# Altium schematic sheet Kello_Mechanical.SchDoc
size A4; ApprovedBy: Krzysztof Belewicz; CheckedBy: Krzysztof Belewicz; Author: Krzysztof Belewicz; DrawnBy: Krzysztof Belewicz; Engineer: Krzysztof Belewicz; Revision: 1.0; SheetNumber: 4; SheetTotal: 4
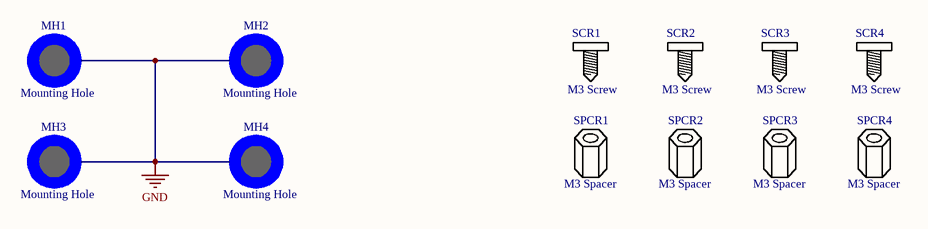
[diagram p0: Kello_Mechanical.SchDoc]

## Parts
MH1  Mounting Hole  [MH-M3_Copper]  (no BOM)
MH2  Mounting Hole  [MH-M3_Copper]  (no BOM)
MH3  Mounting Hole  [MH-M3_Copper]  (no BOM)
MH4  Mounting Hole  [MH-M3_Copper]  (no BOM)
SCR1  M3 Screw  (mechanical)
SCR2  M3 Screw  (mechanical)
SCR3  M3 Screw  (mechanical)
SCR4  M3 Screw  (mechanical)
SPCR1  M3 Spacer  (mechanical)
SPCR2  M3 Spacer  (mechanical)
SPCR3  M3 Spacer  (mechanical)
SPCR4  M3 Spacer  (mechanical)

## Nets
GND: MH1.MH MH2.MH MH3.MH MH4.MH

## Notes on the sheet
- Project:
- Variant:
- File:
- Sheet:
- Revision:
- Total Sheet:
- Author:
- Modified:

## Library data of the parts
MH1-MH4 = MH: M3 mounting hole
SCR1-SCR4 = SCREW: Supplier 1: *; Manufacturer 1: *; Supplier Part Number 1: *; Manufacturer Part Number 1: *
SPCR1-SPCR4 = SPCR: Supplier 1: *; Manufacturer 1: *; Supplier Part Number 1: *; Manufacturer Part Number 1: *